# Altium schematic sheet p4_esp32.SchDoc
size A2; Organization: ORGANIZATION; Address1: ADDRESS 1; Address2: ADDRESS 2; Address3: ADDRESS 3; Address4: ADDRESS 4; Revision: Rev. A; SheetNumber: 4; SheetTotal: 8; ENG_APP_DATE: --/--/--; DSN_APP_DATE: --/--/--; CHK_APP_DATE: --/--/--
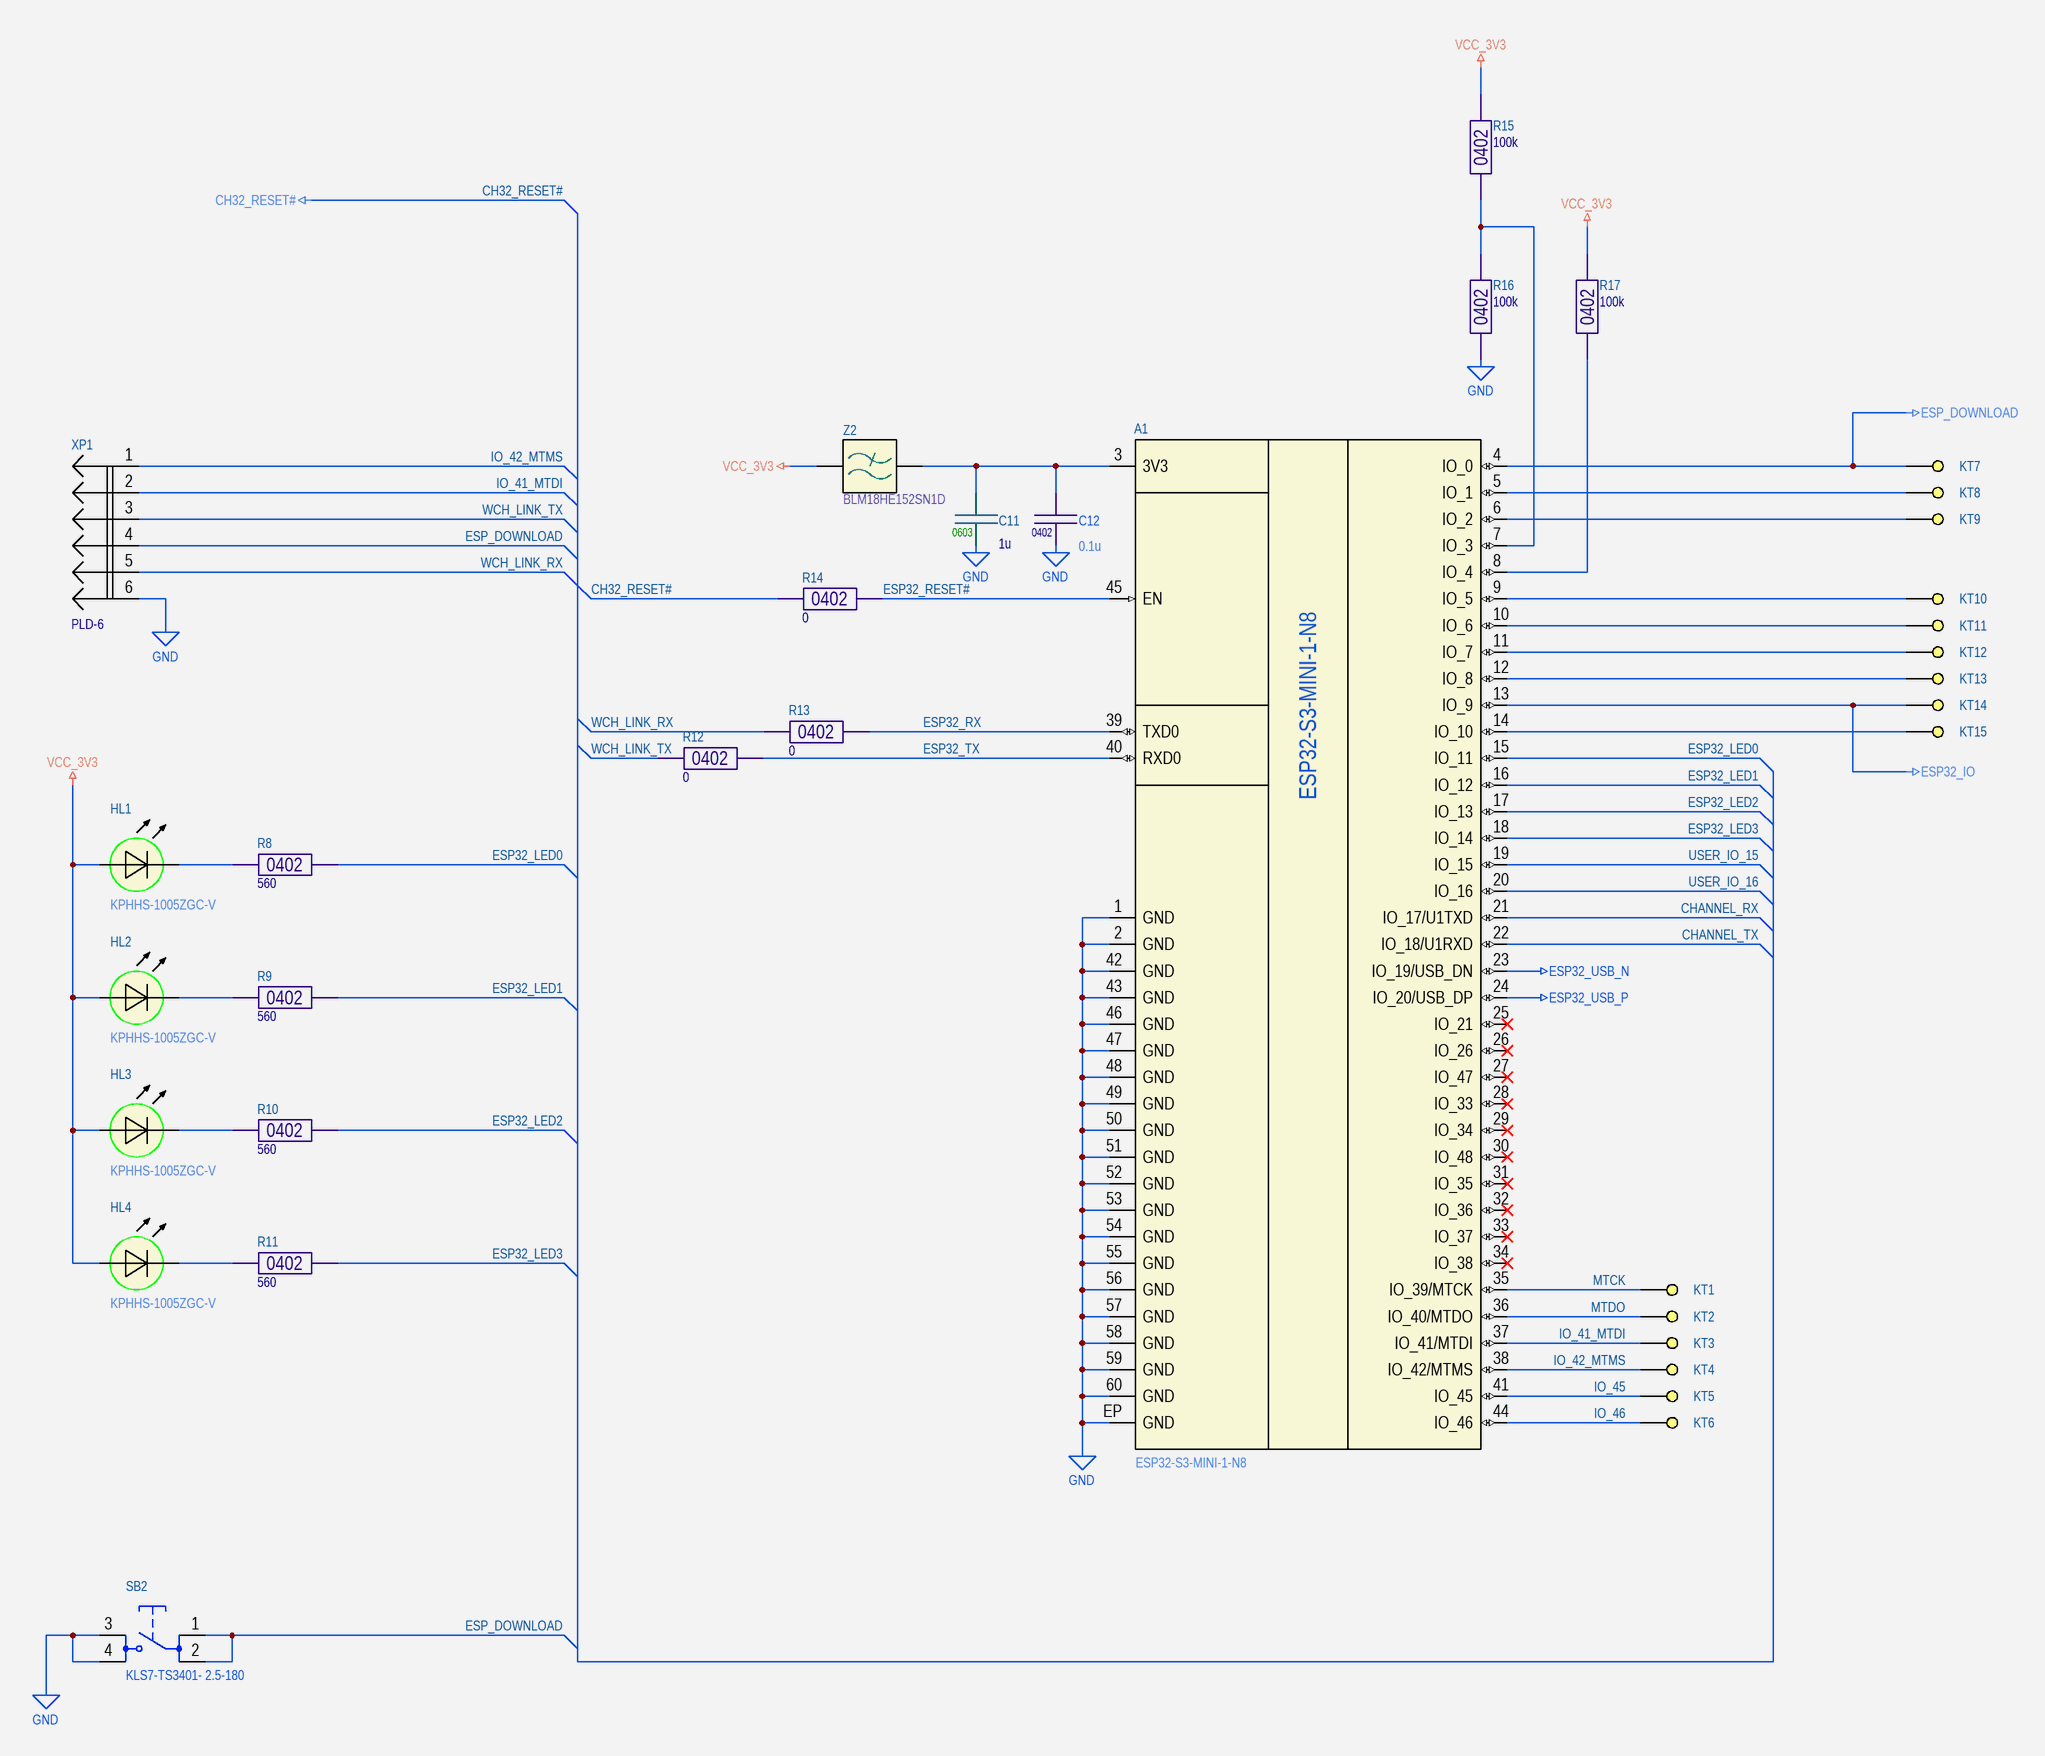
[diagram p0: p4_esp32.SchDoc]

## Parts
A1  ESP32-S3-MINI-1-N8  [ESP32-S3-MINI-1]
C11  1u  Package: 0603  [CAP0603]
C12  0.1u  Package: 0402  [CAP0402]
HL1  KPHHS-1005ZGC-V  [LED0402G525]
HL2  KPHHS-1005ZGC-V  [LED0402G525]
HL3  KPHHS-1005ZGC-V  [LED0402G525]
HL4  KPHHS-1005ZGC-V  [LED0402G525]
KT1  TEST_PAD  [TEST_PAD_R1mm]  (value not drawn)  (net tie, no BOM)
KT2  TEST_PAD  [TEST_PAD_R1mm]  (value not drawn)  (net tie, no BOM)
KT3  TEST_PAD  [TEST_PAD_R1mm]  (value not drawn)  (net tie, no BOM)
KT4  TEST_PAD  [TEST_PAD_R1mm]  (value not drawn)  (net tie, no BOM)
KT5  TEST_PAD  [TEST_PAD_R1mm]  (value not drawn)  (net tie, no BOM)
KT6  TEST_PAD  [TEST_PAD_R1mm]  (value not drawn)  (net tie, no BOM)
KT7  TEST_PAD  [TEST_PAD_R1mm]  (value not drawn)  (net tie, no BOM)
KT8  TEST_PAD  [TEST_PAD_R1mm]  (value not drawn)  (net tie, no BOM)
KT9  TEST_PAD  [TEST_PAD_R1mm]  (value not drawn)  (net tie, no BOM)
KT10  TEST_PAD  [TEST_PAD_R1mm]  (value not drawn)  (net tie, no BOM)
KT11  TEST_PAD  [TEST_PAD_R1mm]  (value not drawn)  (net tie, no BOM)
KT12  TEST_PAD  [TEST_PAD_R1mm]  (value not drawn)  (net tie, no BOM)
KT13  TEST_PAD  [TEST_PAD_R1mm]  (value not drawn)  (net tie, no BOM)
KT14  TEST_PAD  [TEST_PAD_R1mm]  (value not drawn)  (net tie, no BOM)
KT15  TEST_PAD  [TEST_PAD_R1mm]  (value not drawn)  (net tie, no BOM)
R8  560  Package: 0402  [RES0402B]
R9  560  Package: 0402  [RES0402B]
R10  560  Package: 0402  [RES0402B]
R11  560  Package: 0402  [RES0402B]
R12  0  Package: 0402  [RES0402B]
R13  0  Package: 0402  [RES0402B]
R14  0  Package: 0402  [RES0402B]
R15  100k  Package: 0402  [RES0402B]
R16  100k  Package: 0402  [RES0402B]
R17  100k  Package: 0402  [RES0402B]
SB2  KLS7-TS3401- 2.5-180  [TVAF11]
XP1  PLD-6  [PLD-6]
Z2  BLM18HE152SN1D  [BLM0603C]

## Nets
CH32_RESET#: R14.2
ESP32_IO: A1.13(IO_9) KT14.1
ESP32_USB_N: A1.23(IO_19/USB_DN)
ESP32_USB_P: A1.24(IO_20/USB_DP)
ESP_DOWNLOAD: A1.4(IO_0) KT7.1 SB2.1 SB2.2 XP1.4
GND: A1.1(GND) A1.2(GND) A1.42(GND) A1.43(GND) A1.46(GND) A1.47(GND) A1.48(GND) A1.49(GND) A1.50(GND) A1.51(GND) A1.52(GND) A1.53(GND) A1.54(GND) A1.55(GND) A1.56(GND) A1.57(GND) A1.58(GND) A1.59(GND) A1.60(GND) A1.EP(GND) C11.1 C12.2 R16.2 SB2.3 SB2.4 XP1.6
VCC_3V3: HL1.2 HL2.2 HL3.2 HL4.2 R15.1 R17.1 Z2.2
CHANNEL_RX: A1.21(IO_17/U1TXD)
CHANNEL_TX: A1.22(IO_18/U1RXD)
ESP32_LED0: A1.15(IO_11) R8.2
ESP32_LED1: A1.16(IO_12) R9.2
ESP32_LED2: A1.17(IO_13) R10.2
ESP32_LED3: A1.18(IO_14) R11.2
ESP32_RESET#: A1.45(EN) R14.1
ESP32_RX: A1.39(TXD0) R13.2
ESP32_TX: A1.40(RXD0) R12.2
IO_41_MTDI: A1.37(IO_41/MTDI) KT3.1 XP1.2
IO_42_MTMS: A1.38(IO_42/MTMS) KT4.1 XP1.1
IO_45: A1.41(IO_45) KT5.1
IO_46: A1.44(IO_46) KT6.1
MTCK: A1.35(IO_39/MTCK) KT1.1
MTDO: A1.36(IO_40/MTDO) KT2.1
USER_IO_15: A1.19(IO_15)
USER_IO_16: A1.20(IO_16)
WCH_LINK_RX: R13.1 XP1.5
WCH_LINK_TX: R12.1 XP1.3
NetA1_3: A1.3(3V3) C11.2 C12.1 Z2.1
NetA1_5: A1.5(IO_1) KT8.1
NetA1_6: A1.6(IO_2) KT9.1
NetA1_7: A1.7(IO_3) R15.2 R16.1
NetA1_8: A1.8(IO_4) R17.2
NetA1_9: A1.9(IO_5) KT10.1
NetA1_10: A1.10(IO_6) KT11.1
NetA1_11: A1.11(IO_7) KT12.1
NetA1_12: A1.12(IO_8) KT13.1
NetA1_14: A1.14(IO_10) KT15.1
NetHL1_1: HL1.1 R8.1
NetHL2_1: HL2.1 R9.1
NetHL3_1: HL3.1 R10.1
NetHL4_1: HL4.1 R11.1

Not connected (* = marked no-connect by the designer): A1 25(IO_21)* 26(IO_26)* 27(IO_47)* 28(IO_33)* 29(IO_34)* 30(IO_48)* 31(IO_35)* 32(IO_36)* 33(IO_37)* 34(IO_38)*

## Notes on the sheet
- A2
- GitHub <https://github.com/kirra-cat/druino-uno>
- view on

## Library data of the parts
A1 = ESP32-S3-MINI-1-N8: 2.4 GHz WiFi + Bluetooth® + Bluetooth LE module; Manufacturer: Espressif Systems; Part Number: ESP32-S3-MINI-1-N8
C11 = C0603: Capacitors 0603 package case; Part Number: TCC0603X7R106M6R3CT; Manufacturer: CCTC; Tolerance: ± 20 %; Dielectric: X7R; Voltage: 6.3V; Value: 1u; Value on schem: 1u
C12 = C0402: Capacitors 0402 package case; Part Number: TCC0402X7R104J500AT; Manufacturer: CCTC; Tolerance: ± 5 %; Dielectric: X7R; Voltage: 50 V; Value: 0.1u; Value on schem: 0.1u
HL1-HL4 = KPHHS-1005ZGC-V: Green led (package case 0402); Manufacturer: Kingbright Company LLC.; Designator: HL*; Forward Current: 20 mA; Forward Voltage: 3.3V; Wavelength: 515 nm; Package: 0402; Part Number: KPHHS-1005ZGC-V; Color: Green
KT1-KT15 = TEST_PAD: Test pad
R8-R11 = R0402: Resistor 0402 package case; Part Number: RC0402FR-07560RL; Manufacturer: Yageo; Tolerance: ± 1 %; Temperature Coefficient: ±100 ppm/K; Value: 560; Value on schem: 560
R12-R14 = R0402: Resistor 0402 package case; Part Number: RC0402FR-070RL; Manufacturer: Yageo; Tolerance: ± 1 %; Temperature Coefficient: ±100 ppm/K; Value: 0; Value on schem: 0
R15-R17 = R0402: Resistor 0402 package case; Part Number: RC0402FR-07100KL; Manufacturer: Yageo; Tolerance: ± 1 %; Temperature Coefficient: ±100 ppm/K; Value: 100k; Value on schem: 100k
SB2 = TVAF11: Tact Button SMD 4х3х2.5mm; Manufacturer: KLS; Package: 3x4mm; Part Number: KLS7-TS3401- 2.5-180
Z2 = BLM18HE152SN1D: Power line filter, imperdance 1500 Ohm @100MHz (current 0.5A); Manufacturer: Murata; Part Number: BLM18HE152SN1D; Package: 0603
XP1 = PLD-6: Value: PLD-6